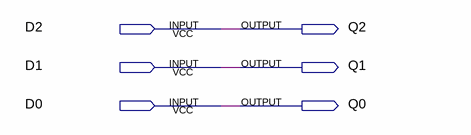
[diagram p0: schematic sheet]
// Quartus schematic MEF_estado.bdf as structural Verilog: 0 symbols, 6 pins
module MEF_estado (
  input  D2,
  input  D1,
  input  D0,
  output Q2,
  output Q1,
  output Q0
);


  assign Q0 = D0;
  assign Q1 = D1;
  assign Q2 = D2;
endmodule
